# EAGLE design Arduino2 (EAGLE 6.6.0)
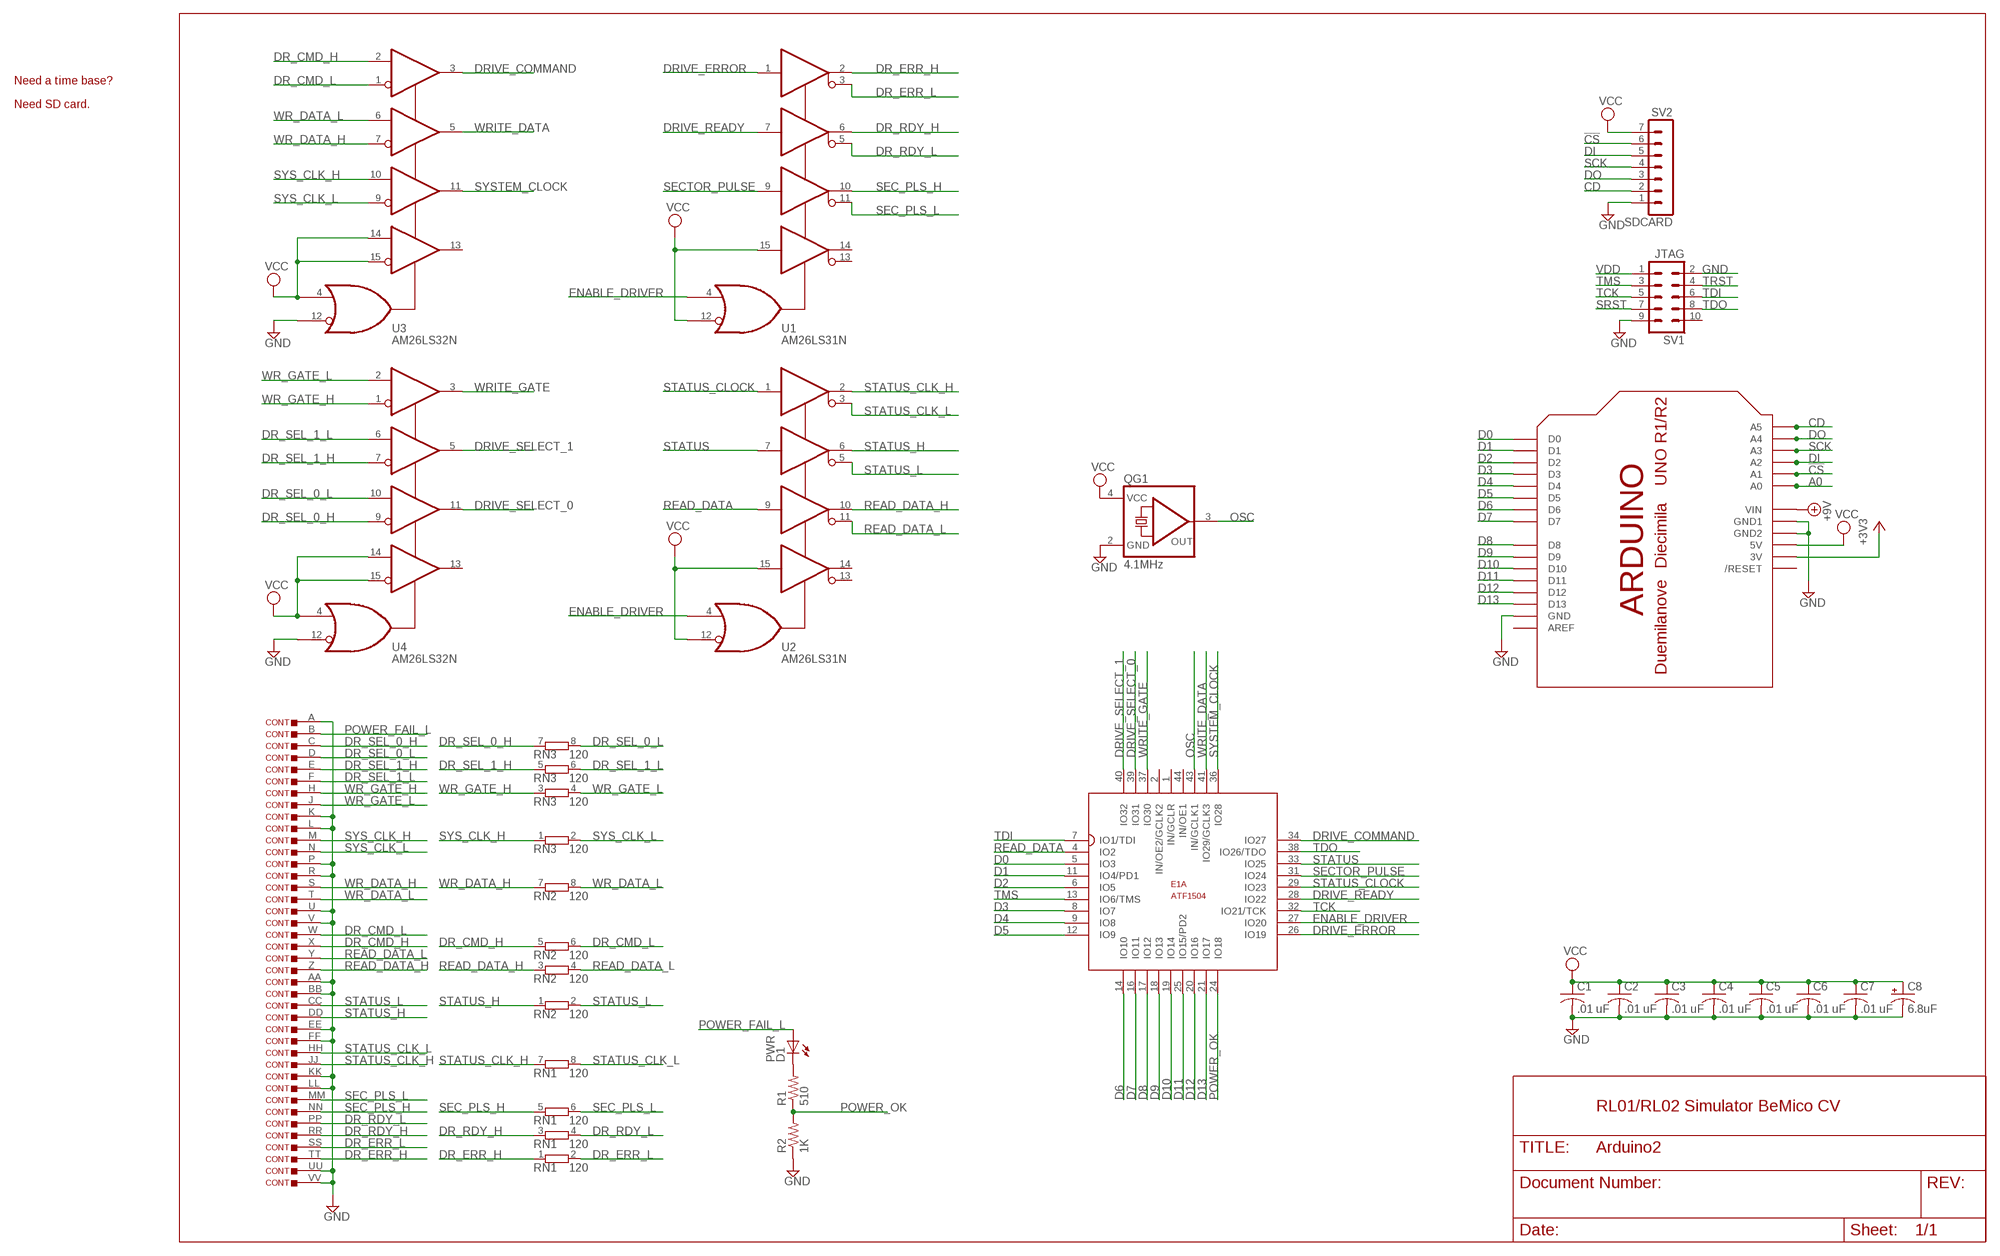
[diagram p0: schematic, sheet 1]

## Parts
C1  .01 uF  C-US050-025X075  [C050-025X075]
C2  .01 uF  C-US050-025X075  [C050-025X075]
C3  .01 uF  C-US050-025X075  [C050-025X075]
C4  .01 uF  C-US050-025X075  [C050-025X075]
C5  .01 uF  C-US050-025X075  [C050-025X075]
C6  .01 uF  C-US050-025X075  [C050-025X075]
C7  .01 uF  C-US050-025X075  [C050-025X075]
C8  6.8uF  CPOL-USE5-5  [E5-5]
CONT  DEC40PINSV  [DEC40PINV]
D1  PWR  LED5MM  [LED5MM]
E1  ATF1504  ATF150X44  [3M44]
QG1  4.1MHz  SG531  [DIL08-4]
R1  510  R-US_0207/10  [0207/10]
R2  1K  R-US_0207/10  [0207/10]
RN1  120  E4RP  [SIL8]
RN2  120  E4RP  [SIL8]
RN3  120  E4RP  [SIL8]
SV1  JTAG  ML10  [ML10]
SV2  SDCARD  MA07-1  [MA07-1]
U1  AM26LS31N  [DIL16]
U2  AM26LS31N  [DIL16]
U3  AM26LS32N  [DIL16]
U4  AM26LS32N  [DIL16]
U$3  ARDUINODUE  [ARDUINO_DUE_SHIELD]

## Nets
!CS: SV2.6 U$3.A1
+3V3: U$3.3V3(3V)
+9V: U$3.VIN
A0: U$3.A0
CD: SV2.2 U$3.A5
D0: E1.5(A:IO3) U$3.0(D0)
D1: E1.11(A:IO4/PD1) U$3.1(D1)
D2: E1.6(A:IO5) U$3.2(D2)
D3: E1.8(A:IO7) U$3.3(D3)
D4: E1.9(A:IO8) U$3.4(D4)
D5: E1.12(A:IO9) U$3.5(D5)
D6: E1.14(A:IO10) U$3.6(D6)
D7: E1.16(A:IO11) U$3.7(D7)
D8: E1.17(A:IO12) U$3.8(D8)
D9: E1.18(A:IO13) U$3.9(D9)
D10: E1.19(A:IO14) U$3.10(D10)
D11: E1.25(A:IO15/PD2) U$3.11(D11)
D12: E1.20(A:IO16) U$3.12(D12)
D13: E1.21(A:IO17) U$3.13(D13)
DI: SV2.5 U$3.A2
DO: SV2.3 U$3.A4
DR_CMD_H: CONT.X RN2.5 U3.2(P1)
DR_CMD_L: CONT.W RN2.6 U3.1(N1)
DR_ERR_H: CONT.TT RN1.1 U1.2(Y1)
DR_ERR_L: CONT.SS RN1.2 U1.3(Z1)
DR_RDY_H: CONT.RR RN1.3 U1.6(Y2)
DR_RDY_L: CONT.PP RN1.4 U1.5(Z2)
DR_SEL_0_H: CONT.C RN3.7 U4.9(N3)
DR_SEL_0_L: CONT.D RN3.8 U4.10(P3)
DR_SEL_1_H: CONT.E RN3.5 U4.7(N2)
DR_SEL_1_L: CONT.F RN3.6 U4.6(P2)
DRIVE_COMMAND: E1.34(A:IO27) U3.3(Y1)
DRIVE_ERROR: E1.26(A:IO19) U1.1(A1)
DRIVE_READY: E1.28(A:IO22) U1.7(A2)
DRIVE_SELECT_0: E1.39(A:IO31) U4.11(Y3)
DRIVE_SELECT_1: E1.40(A:IO32) U4.5(Y2)
ENABLE_DRIVER: E1.27(A:IO20) U1.4(G) U2.4(G)
GND [supply]: C1.2 C2.2 C3.2 C4.2 C5.2 C6.2 C7.2 C8.- CONT.A CONT.AA CONT.BB CONT.EE CONT.FF CONT.K CONT.KK CONT.L CONT.LL CONT.P CONT.R CONT.U CONT.UU CONT.V CONT.VV QG1.2(GND) R2.1 SV1.2 SV1.9 SV2.1 U3.12(!G) U4.12(!G) U$3.GND U$3.GND_1(GND1) U$3.GND_2(GND2)
N$1: D1.K(C) R1.2
N$2: U$3.AREF
N$9: U$3.RESET(/RESET)
OSC: E1.43(A:IN/GCLK1) QG1.3(OUT)
POWER_FAIL_L: CONT.B D1.A
POWER_OK: E1.24(A:IO18) R1.1 R2.2
READ_DATA: E1.4(A:IO2) U2.9(A3)
READ_DATA_H: CONT.Z RN2.3 U2.10(Y3)
READ_DATA_L: CONT.Y RN2.4 U2.11(Z3)
SCK: SV2.4 U$3.A3
SEC_PLS_H: CONT.NN RN1.5 U1.10(Y3)
SEC_PLS_L: CONT.MM RN1.6 U1.11(Z3)
SECTOR_PULSE: E1.31(A:IO24) U1.9(A3)
SRST: SV1.7
STATUS: E1.33(A:IO25) U2.7(A2)
STATUS_CLK_H: CONT.JJ RN1.7 U2.2(Y1)
STATUS_CLK_L: CONT.HH RN1.8 U2.3(Z1)
STATUS_CLOCK: E1.29(A:IO23) U2.1(A1)
STATUS_H: CONT.DD RN2.1 U2.6(Y2)
STATUS_L: CONT.CC RN2.2 U2.5(Z2)
SYS_CLK_H: CONT.M RN3.1 U3.10(P3)
SYS_CLK_L: CONT.N RN3.2 U3.9(N3)
SYSTEM_CLOCK: E1.36(A:IO28) U3.11(Y3)
TCK: E1.32(A:IO21/TCK) SV1.5
TDI: E1.7(A:IO1/TDI) SV1.6
TDO: E1.38(A:IO26/TDO) SV1.8
TMS: E1.13(A:IO6/TMS) SV1.3
TRST: SV1.4
VCC [supply]: C1.1 C2.1 C3.1 C4.1 C5.1 C6.1 C7.1 C8.+ QG1.4(VCC) SV2.7 U1.12(!G) U1.15(A4) U2.12(!G) U2.15(A4) U3.4(G) U3.14(P4) U3.15(N4) U4.4(G) U4.14(P4) U4.15(N4) U$3.5V0(5V)
VDD: SV1.1
WR_DATA_H: CONT.S RN2.7 U3.7(N2)
WR_DATA_L: CONT.T RN2.8 U3.6(P2)
WR_GATE_H: CONT.H RN3.3 U4.1(N1)
WR_GATE_L: CONT.J RN3.4 U4.2(P1)
WRITE_DATA: E1.41(A:IO29/GCLK3) U3.5(Y2)
WRITE_GATE: E1.37(A:IO30) U4.3(Y1)
Unconnected: E1.1(A:IN/GCLR) E1.2(A:IN/OE2/GCLK2) E1.44(A:IN/OE1) SV1.10 U1.13(Z4) U1.14(Y4) U2.13(Z4) U2.14(Y4) U3.13(Y4) U4.13(Y4)

## Notes on the sheet
- Need a time base?
- Need SD card.
- RL01/RL02 Simulator BeMico CV

## Power pins joined to a net without a drawn wire
GND: E1.10(GND) E1.22(GND) E1.30(GND) E1.42(GND) U1.8(GND) U2.8(GND) U3.8(GND) U4.8(GND)
VCC: E1.3(VCC) E1.15(VCC) E1.23(VCC) E1.35(VCC) U1.16(VCC) U2.16(VCC) U3.16(VCC) U4.16(VCC)

## Library data of the parts
C1-C7 = rcl:C-US: CAPACITOR, American symbol
C8 = rcl:CPOL-US: POLARIZED CAPACITOR, American symbol
CONT = dec-con:DEC40PINS: 40 pin ribbon connector for BC08, BC11 cables.
D1 = led:LED: LED OSRAM: - CHIPLED LG R971, LG N971, LY N971, LG Q971, LY Q971, LO R971, LY R971 LH N974, LH R974 LS Q976, LO Q976, LY Q976 LO Q996 - Hyper CHIPLED LW Q18S LB Q993, LB Q99A, LB R99A - SideLED LS A670, LO A670, LY A670, LG A670, LP A670 LB A673, LV A673, LT A673, LW A673 LH A674 LY A675 LS A676, LA A676, LO A676, LY A676, LW A676 LS A679, LY A679, LG A679 - Hyper Micro SIDELED® LS Y876, LA Y876, LO Y876, LY Y876 LT Y87S - SmartLED LW L88C, LW L88S LB L89C, LB L89S, LG L890 LS L89K, LO L89K, LY L89K LS L896, LA L896, LO L896, LY L896 - TOPLED LS T670, LO T670, LY T670, LG T670, LP T670 LSG T670, LSP T670, LSY T670, LOP T670, LYG T670 LG T671, LOG T671, LSG T671 LB T673, LV T673, LT T673, LW T673 LH T674 LS T676, LA T676, LO T676, LY T676, LB T676, LH T676, LSB T676, LW T676 LB T67C, LV T67C, LT T67C, LS T67K, LO T67K, LY T67K, LW E67C LS E67B, LA E67B, LO E67B, LY E67B, LB E67C, LV E67C, LT E67C LW T67C LS T679, LY T679, LG T679 LS T770, LO T770, LY T770, LG T770, LP T770 LB T773, LV T773, LT T773, LW T773 LH T774 LS E675, LA E675, LY E675, LS T675 LS T776, LA T776, LO T776, LY T776, LB T776 LHGB T686 LT T68C, LB T68C - Hyper Mini TOPLED® LB M676 - Mini TOPLED Santana® LG M470 LS M47K, LO M47K, LY M47K Source: http://www.osram.convergy.de LUXEON: - LUMILED® LXK2-PW12-R00, LXK2-PW12-S00, LXK2-PW14-U00, LXK2-PW14-V00 LXK2-PM12-R00, LXK2-PM12-S00, LXK2-PM14-U00 LXK2-PE12-Q00, LXK2-PE12-R00, LXK2-PE12-S00, LXK2-PE14-T00, LXK2-PE14-U00 LXK2-PB12-K00, LXK2-PB12-L00, LXK2-PB12-M00, LXK2-PB14-N00, LXK2-PB14-P00, LXK2-PB14-Q00 LXK2-PR12-L00, LXK2-PR12-M00, LXK2-PR14-Q00, LXK2-PR14-R00 LXK2-PD12-Q00, LXK2-PD12-R00, LXK2-PD12-S00 LXK2-PH12-R00, LXK2-PH12-S00 LXK2-PL12-P00, LXK2-PL12-Q00, LXK2-PL12-R00 Source: www.luxeon.com KINGBRIGHT: KA-3528ASYC Source: www.kingbright.com
E1 = atmel-cpld:ATF150X44: ATF150x in 44 pin packages
QG1 = crystal:SG531: CRYSTAL RESONATOR; MPN: SG531P16MHZ; OC_FARNELL: unknown; OC_NEWARK: 01M8837
R1 R2 = rcl:R-US_: RESISTOR, American symbol
RN1-RN3 = resistor-sil:E4RP: SIL RESISTOR; OC_FARNELL: unknown; OC_NEWARK: unknown
SV1 = con-ml:ML10: HARTING; OC_FARNELL: unknown; OC_NEWARK: unknown
SV2 = con-lstb:MA07-1: PIN HEADER; OC_FARNELL: unknown; OC_NEWARK: unknown
U1 U2 = dec-con:AM26LS31: Quad RS-422 Driver
U3 U4 = dec-con:AM26LS32: Quad Differential Reciever
U$3 = arduino:ARDUINO: Arduino Diecimila/Duemilanove Make a shield with ease, this package has all the named pins as well as the two mounting drill holes and an outline of the USB and DC power connector. The outline is on the DIMENSION layer, so if your board house uses it they will cut the outline to match. http://www.ladyada.net/library/pcb/eaglelibrary.html

## Net classes
1 supply: width 0.508 mm

## Board
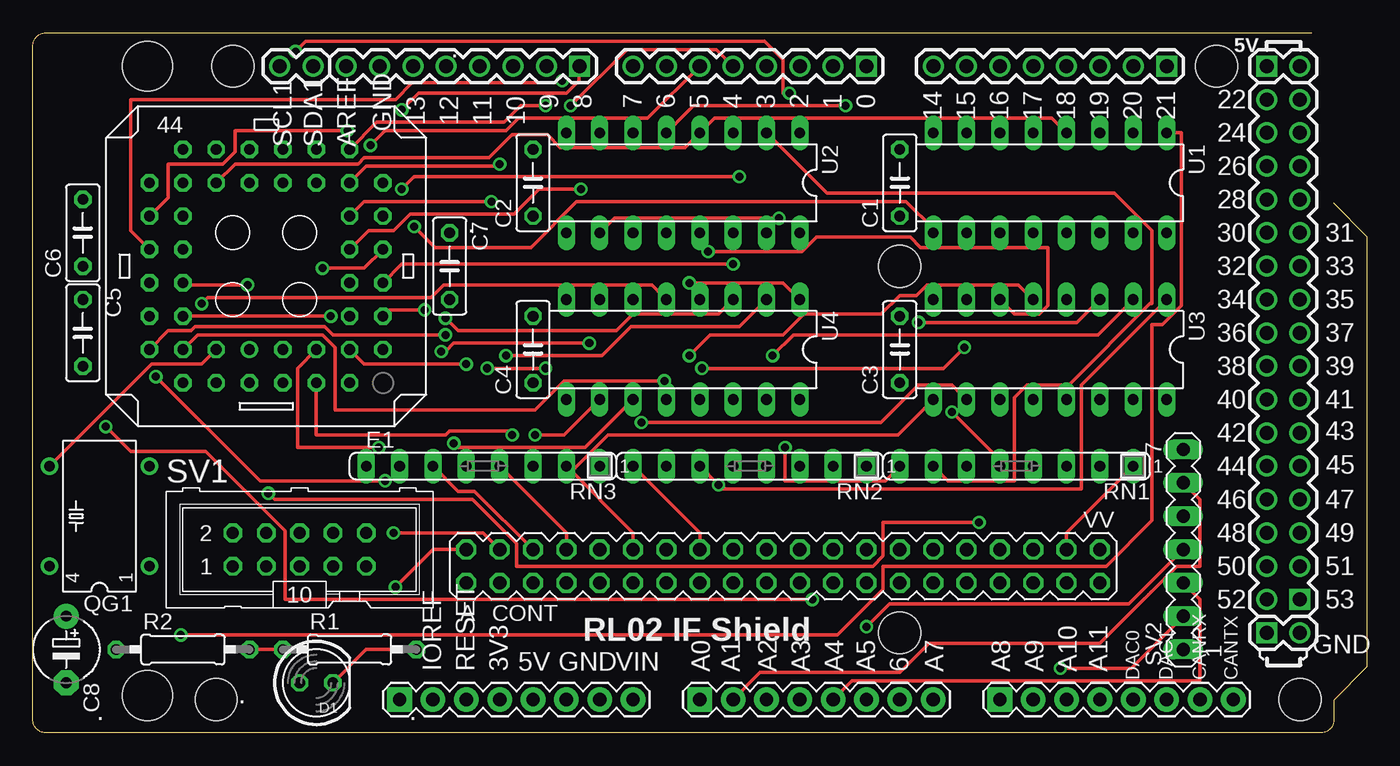
[diagram p1: board, top side]
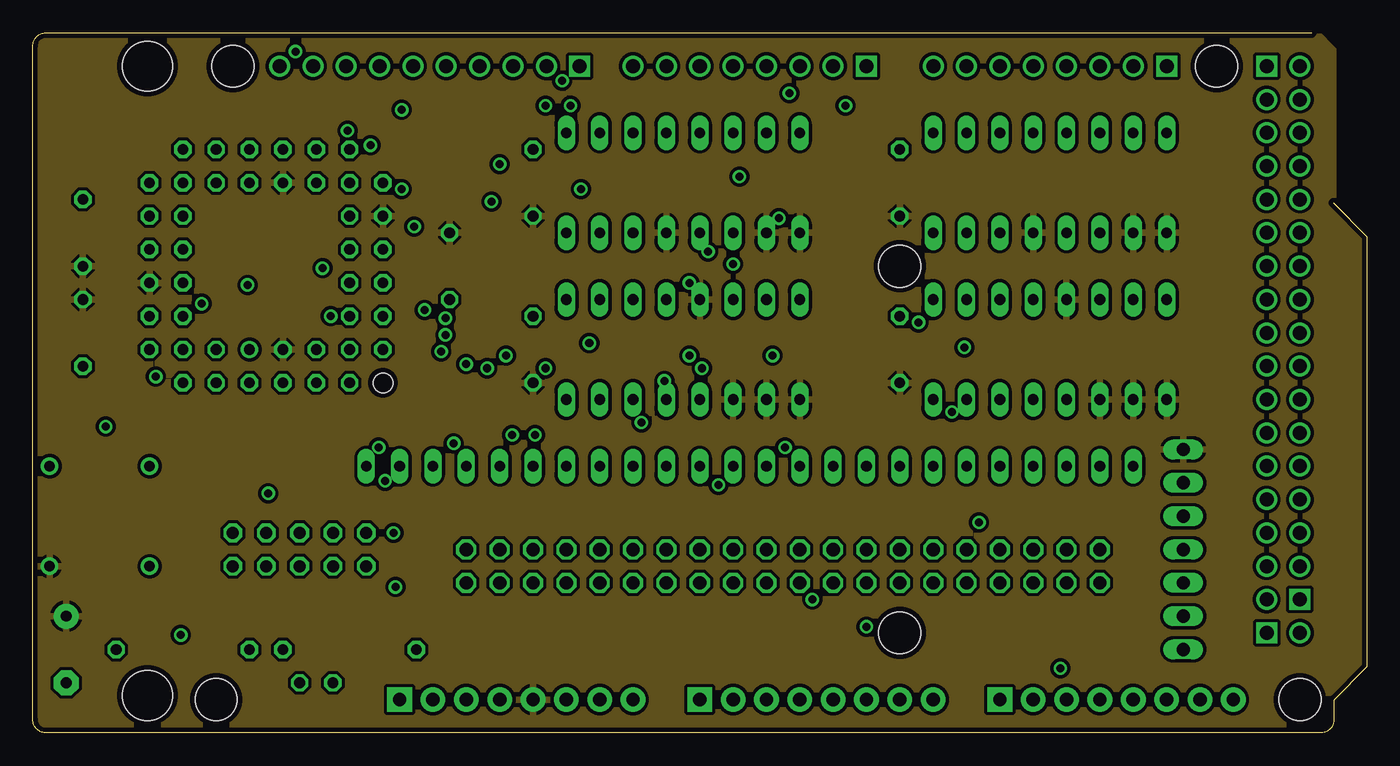
[diagram p2: board, inner layer $VCC]
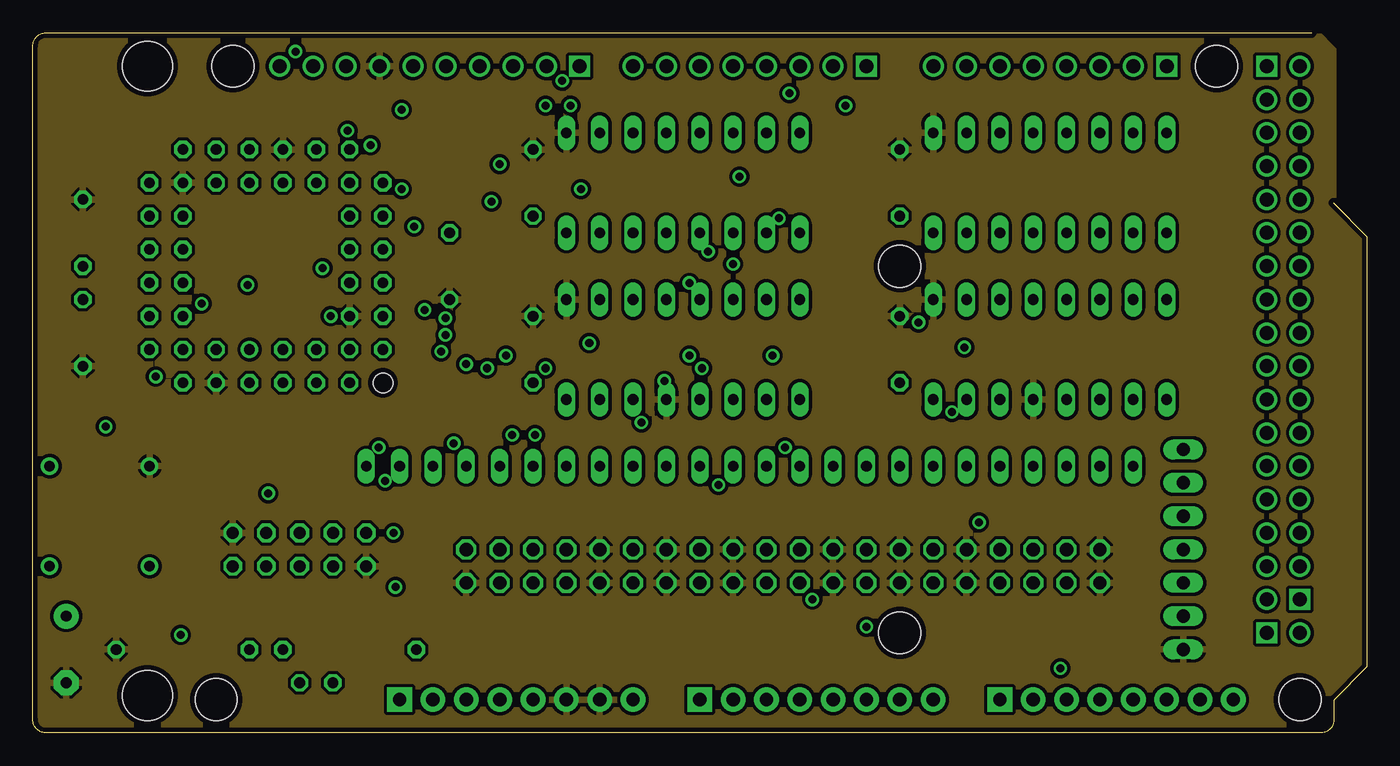
[diagram p3: board, inner layer $GND]
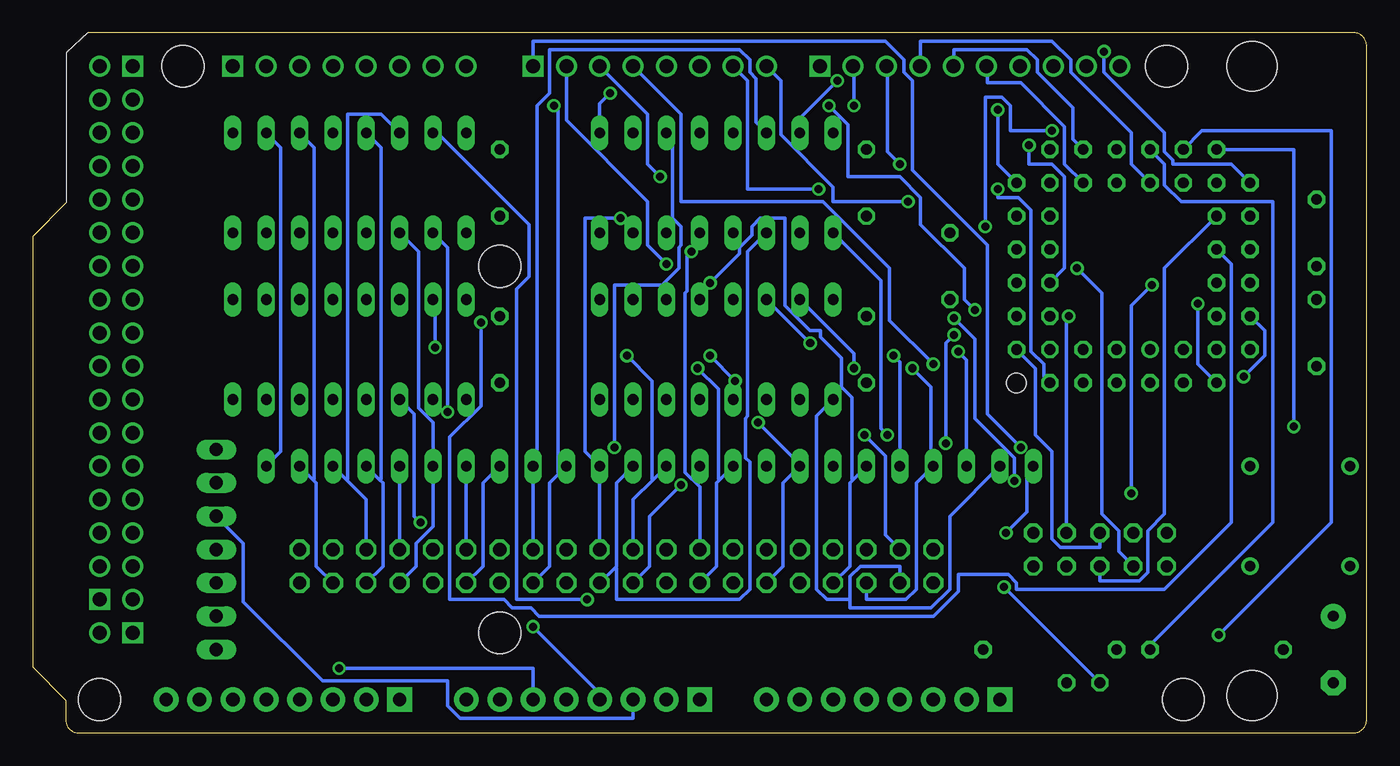
[diagram p4: board, bottom side, seen from below]

Size 101.6 x 53.34 mm. Coordinates in mm from the lower left corner, seen from the top.
Copper layers (1*2*15*16): Top 0.035mm / dielectric 1.5mm / $VCC 0.035mm / dielectric 0.15mm / $GND 0.035mm / dielectric 0.2mm / Bottom 0.035mm
Design rules "10mils *": minimum track width 10mil, minimum drill 24mil, track to track 10mil, track to pad 10mil, pad to pad 10mil, via to via 10mil, smd to smd 0mil, copper to edge 15mil, drill to drill 10mil, minimum pad ring 10mil, minimum via ring 8mil, stop-mask expansion 0mil, vias tented up to drill 0mil, thermal gap 10mil
Holes 3.81 mm at 8.73,50.8 8.73,2.86

### Footprints (pad centres in the part's own frame; a part is rotated, then mirrored left to right if it is on the bottom)
C050-025X075 = drill 0.813 octagon: 1 -2.54,0; 2 2.54,0
E5-5 = drill 0.813 pad 1.905: + -2.54,0 | drill 0.813 pad 1.905 octagon: - 2.54,0
DEC40PINV = drill 1.016 octagon: A -24.13,-1.27; AA 3.81,-1.27; B -24.13,1.27; BB 3.81,1.27; C -21.59,-1.27; CC 6.35,-1.27; D -21.59,1.27; DD 6.35,1.27; E -19.05,-1.27; EE 8.89,-1.27; F -19.05,1.27; FF 8.89,1.27; H -16.51,-1.27; HH 11.43,-1.27; J -16.51,1.27; JJ 11.43,1.27; K -13.97,-1.27; KK 13.97,-1.27; L -13.97,1.27; LL 13.97,1.27; M -11.43,-1.27; MM 16.51,-1.27; N -11.43,1.27; NN 16.51,1.27; P -8.89,-1.27; PP 19.05,-1.27; R -8.89,1.27; RR 19.05,1.27; S -6.35,-1.27; SS 21.59,-1.27; T -6.35,1.27; TT 21.59,1.27; U -3.81,-1.27; UU 24.13,-1.27; V -3.81,1.27; VV 24.13,1.27; W -1.27,-1.27; X -1.27,1.27; Y 1.27,-1.27; Z 1.27,1.27
LED5MM = drill 0.813 octagon: A -1.27,0; K 1.27,0
3M44 = drill 0.813: 1 1.27,6.35 | drill 0.813 octagon: 2 -1.27,8.89; 3 -1.27,6.35; 4 -3.81,8.89; 5 -3.81,6.35; 6 -6.35,8.89; 7 -8.89,6.35; 8 -6.35,6.35; 9 -8.89,3.81; 10 -6.35,3.81; 11 -8.89,1.27; 12 -6.35,1.27; 13 -8.89,-1.27; 14 -6.35,-1.27; 15 -8.89,-3.81; 16 -6.35,-3.81; 17 -8.89,-6.35; 18 -6.35,-8.89; 19 -6.35,-6.35; 20 -3.81,-8.89; 21 -3.81,-6.35; 22 -1.27,-8.89; 23 -1.27,-6.35; 24 1.27,-8.89; 25 1.27,-6.35; 26 3.81,-8.89; 27 3.81,-6.35; 28 6.35,-8.89; 29 8.89,-6.35; 30 6.35,-6.35; 31 8.89,-3.81; 32 6.35,-3.81; 33 8.89,-1.27; 34 6.35,-1.27; 35 8.89,1.27; 36 6.35,1.27; 37 8.89,3.81; 38 6.35,3.81; 39 8.89,6.35; 40 6.35,8.89; 41 6.35,6.35; 42 3.81,8.89; 43 3.81,6.35; 44 1.27,8.89 | hole 1.499: -8.89,8.89
DIL08-4 = drill 0.813: 1 -3.81,-3.81; 2 3.81,-3.81; 3 3.81,3.81; 4 -3.81,3.81
0207/10 = drill 0.813 octagon: 1 -5.08,0; 2 5.08,0
SIL8 = drill 0.813 long: 1 -8.89,0; 2 -6.35,0; 3 -3.81,0; 4 -1.27,0; 5 1.27,0; 6 3.81,0; 7 6.35,0; 8 8.89,0
ML10 = drill 0.914 octagon: 1 -5.08,-1.27; 2 -5.08,1.27; 3 -2.54,-1.27; 4 -2.54,1.27; 5 0,-1.27; 6 0,1.27; 7 2.54,-1.27; 8 2.54,1.27; 9 5.08,-1.27; 10 5.08,1.27
MA07-1 = drill 1.016 long: 1 -7.62,0; 2 -5.08,0; 3 -2.54,0; 4 0,0; 5 2.54,0; 6 5.08,0; 7 7.62,0
DIL16 = drill 0.813 long: 1 -8.89,-3.81; 2 -6.35,-3.81; 3 -3.81,-3.81; 4 -1.27,-3.81; 5 1.27,-3.81; 6 3.81,-3.81; 7 6.35,-3.81; 8 8.89,-3.81; 9 8.89,3.81; 10 6.35,3.81; 11 3.81,3.81; 12 1.27,3.81; 13 -1.27,3.81; 14 -3.81,3.81; 15 -6.35,3.81; 16 -8.89,3.81
ARDUINO_DUE_SHIELD = drill 1.067 square: 0 63.5,50.8; 5V0_1 93.98,50.8; 8 41.656,50.8; 21 86.36,50.8; 53 96.52,10.16; GND_4 93.98,7.62 | drill 1.067: 1 60.96,50.8; 2 58.42,50.8; 3 55.88,50.8; 4 53.34,50.8; 5 50.8,50.8; 5V0_2 96.52,50.8; 6 48.26,50.8; 7 45.72,50.8; 9 39.116,50.8; 10 36.576,50.8; 11 34.036,50.8; 12 31.496,50.8; 13 28.956,50.8; 14 68.58,50.8; 15 71.12,50.8; 16 73.66,50.8; 17 76.2,50.8; 18 78.74,50.8; 19 81.28,50.8; 20 83.82,50.8; 22 93.98,48.26; 23 96.52,48.26; 24 93.98,45.72; 25 96.52,45.72; 26 93.98,43.18; 27 96.52,43.18; 28 93.98,40.64; 29 96.52,40.64; 30 93.98,38.1; 31 96.52,38.1; 32 93.98,35.56; 33 96.52,35.56; 34 93.98,33.02; 35 96.52,33.02; 36 93.98,30.48; 37 96.52,30.48; 38 93.98,27.94; 39 96.52,27.94; 40 93.98,25.4; 41 96.52,25.4; 42 93.98,22.86; 43 96.52,22.86; 44 93.98,20.32; 45 96.52,20.32; 46 93.98,17.78; 47 96.52,17.78; 48 93.98,15.24; 49 96.52,15.24; 50 93.98,12.7; 51 96.52,12.7; 52 93.98,10.16; AREF 23.876,50.8; GND_2 26.416,50.8; GND_3 96.52,7.62; SCL1 18.796,50.8; SDA1 21.336,50.8 | drill 1.016 pad 1.88: 3V3 35.56,2.54; 5V0 38.1,2.54; A1 53.34,2.54; A2 55.88,2.54; A3 58.42,2.54; A4 60.96,2.54; A5 63.5,2.54; A6 66.04,2.54; A7 68.58,2.54; A9 76.2,2.54; A10 78.74,2.54; A11 81.28,2.54; CANRX 88.9,2.54; CANTX 91.44,2.54; DAC0 83.82,2.54; DAC1 86.36,2.54; GND 40.64,2.54; GND_1 43.18,2.54; IOREF 30.48,2.54; RESET 33.02,2.54; VIN 45.72,2.54 | drill 1.016 pad 1.88 square: A0 50.8,2.54; A8 73.66,2.54; NC_2 27.94,2.54 | hole 3.2: 96.52,2.54; 15.24,50.8; 90.17,50.8; 13.97,2.54; 66.04,35.56; 66.04,7.62

### Placement (x,y rotation side)
C1  66.04,41.91 90 top
C2  38.1,41.91 90 top
C3  66.04,29.21 90 top
C4  38.1,29.21 90 top
C5  3.81,30.48 270 top
C6  3.81,38.1 90 top
C7  31.75,35.56 270 top
C8  2.54,6.35 270 top
CONT  57.15,12.7 0 top
D1  21.59,3.81 0 top
E1  17.78,35.56 180 top
QG1  5.08,16.51 90 top
R1  24.13,6.35 0 top
R2  11.43,6.35 0 top
RN1  74.93,20.32 180 top
RN2  54.61,20.32 180 top
RN3  34.29,20.32 180 top
SV1  20.32,13.97 0 top
SV2  87.63,13.97 90 top
U1  77.47,41.91 180 top
U2  49.53,41.91 180 top
U3  77.47,29.21 180 top
U4  49.53,29.21 180 top
U$3  0,0 0 top

### Tracks (layer width: path | path; a pad name or v marks a point on that pad's centre or on a via)
!CS
  Top 0.254: SV2.6 88.9,17.78 88.9,12.7 87.15,12.7 81.28,6.83 68.26,6.83 66.04,4.6 55.4,4.6 U$3.A1
CD  (via drill 0.61)
  Top 0.254: SV2.2 83.66,4.92 v78.26,4.92
  Bottom 0.254: v78.26,4.92 63.5,4.92 U$3.A5
D0  (via drill 0.61)
  Top 0.254: E1.5 20.16,27.78 20.16,21.75 v26.35,21.75
  Bottom 0.254: v26.35,21.75 28.89,24.29 28.89,37.15 34.61,42.86 34.61,49.69 35.24,50.32 35.24,51.28 36.67,52.7 63.5,52.7 U$3.0
D1  (via drill 0.61)
  Top 0.254: E1.11 28.1,35.72 v53.34,35.72
  Bottom 0.254: v53.34,35.72 54.77,37.15 54.77,40.48 60.96,46.67 U$3.1
D2  (via drill 0.61)
  Top 0.254: v28.1,41.43 29.05,42.39 v53.82,42.39
  Bottom 0.254: E1.6 24.61,27.15 24.61,28.1 25.56,29.05 25.56,39.85 26.51,40.8 28.1,40.8 v28.1,41.43 | v53.82,42.39 54.77,43.34 54.77,47.15 U$3.2
D3  (via drill 0.61)
  Top 0.254: E1.8 25.24,28.1 v33.02,28.1
  Bottom 0.254: v33.02,28.1 36.35,31.43 36.35,35.4 41.43,40.48 52.23,40.48 52.23,47.15 U$3.3
D4  (via drill 0.61)
  Top 0.254: E1.9 27.15,32.23 v29.84,32.23 | v40.96,47.78 45.24,52.07 52.07,52.07 U$3.4
  Bottom 0.254: v29.84,32.23 30.64,33.02 30.64,35.4 33.97,38.73 33.97,40.8 35.56,42.39 39.53,42.39 39.53,46.35 v40.96,47.78
D5  (via drill 0.61)
  Top 0.254: v25.72,44.77 26.83,45.88 36.04,45.88 36.99,46.83 46.83,46.83 U$3.5
  Bottom 0.254: E1.12 23.02,35.4 23.02,42.39 23.97,43.34 25.72,43.34 v25.72,44.77
D6  (via drill 0.61)
  Top 0.254: E1.14 25.56,38.26 27.46,38.26 28.73,39.53 36.67,39.53 38.58,41.43 v41.75,41.43
  Bottom 0.254: v41.75,41.43 47.15,41.43 47.15,49.69 U$3.6
D7  (via drill 0.61)
  Top 0.254: E1.16 25.24,40.48 v34.92,40.48
  Bottom 0.254: v34.92,40.48 40.64,40.48 40.64,41.59 44.61,45.56 44.61,49.69 U$3.7
D8  (via drill 0.61)
  Top 0.254: v28.1,47.47 29.37,48.74 40.64,48.74 41.59,49.69 41.59,50.8 U$3.8
  Bottom 0.254: E1.17 28.1,43.34 v28.1,47.47
D9  (via drill 0.61)
  Top 0.254: E1.18 26.19,46.51 35.88,46.51 37.15,47.78 v39.05,47.78
  Bottom 0.254: v39.05,47.78 39.05,50.8 U$3.9
D10  (via drill 0.61)
  Top 0.254: E1.19 25.4,43.18 35.4,43.18 v35.56,43.34
  Bottom 0.254: v35.56,43.34 36.51,44.29 36.51,50.8 U$3.10
D11
  Bottom 0.254: E1.25 17.94,43.34 17.94,45.72 22.54,50.32 22.54,51.28 23.97,52.7 33.97,52.7 33.97,50.8 U$3.11
D12
  Bottom 0.254: E1.20 22.38,45.24 22.38,47.62 25.08,50.32 25.08,51.28 25.88,52.07 31.43,52.07 31.43,50.8 U$3.12
D13
  Bottom 0.254: E1.21 23.02,43.34 23.02,46.2 26.35,49.53 28.89,49.53 28.89,50.8 U$3.13
DI
  Bottom 0.254: SV2.5 85.57,14.45 85.57,10 79.53,3.97 70.01,3.97 70.01,2.06 69.06,1.11 55.88,1.11 U$3.A2
DO
  Top 0.254: SV2.3 88.9,10.16 88.9,3.97 62.39,3.97 U$3.A4
DR_CMD_H  (via drill 0.61)
  Top 0.254: U3.2 81.12,30.32 57.94,30.32 v56.36,28.73
  Bottom 0.254: 54.37,19.29 55.88,17.78 CONT.X | 54.37,19.29 RN2.5 | v56.36,28.73 54.45,26.83 54.45,19.37 54.37,19.29
DR_CMD_L  (via drill 0.61)
  Top 0.254: RN2.6 v52.23,18.89 52.55,18.57 79.85,18.57 79.85,26.51 U3.1
  Bottom 0.254: v52.23,18.89 54.61,16.51 54.61,12.7 CONT.W
DR_ERR_H
  Top 0.254: RN1.1 78.74,15.24 CONT.TT
  Bottom 0.254: U1.2 82.71,44.61 82.71,21.43 RN1.1
DR_ERR_L
  Bottom 0.254: 80.25,19.29 80.01,19.05 80.01,12.7 CONT.SS | 80.25,19.29 RN1.2 | U1.3 80.17,44.61 80.17,19.37 80.25,19.29
DR_RDY_H
  Bottom 0.254: 77.71,19.29 76.2,17.78 CONT.RR | 77.71,19.29 RN1.3 | U1.6 75.09,47.15 77.63,47.15 77.63,19.37 77.71,19.29
DR_RDY_L
  Bottom 0.254: 75.17,19.29 74.93,19.05 74.93,12.7 CONT.PP | 75.17,19.29 RN1.4 | U1.5 75.09,44.61 75.09,19.37 75.17,19.29
DR_SEL_0_H
  Bottom 0.254: RN3.7 31.75,16.51 31.75,10.95 33.18,9.53 39.37,9.53 39.37,10.16 | 39.37,10.16 39.37,11.91 38.58,12.7 35.56,12.7 CONT.C | U4.9 41.91,24.13 41.91,10.95 41.12,10.16 39.37,10.16
DR_SEL_0_L  (via drill 0.61)
  Top 0.254: v27.46,15.24 34.29,15.24 CONT.D | U4.10 40.48,22.7 v38.26,22.7
  Bottom 0.254: RN3.8 25.88,19.84 25.88,16.83 v27.46,15.24 | v38.26,22.7 36.67,21.11 36.67,15.08 CONT.D
DR_SEL_1_H  (via drill 0.61)
  Top 0.254: v34.61,27.78 v39.05,27.78
  Bottom 0.254: CONT.E 38.1,10.16 35.08,10.16 34.29,10.95 34.29,19.05 RN3.5 33.18,20.32 33.18,26.35 v34.61,27.78 | U4.7 39.05,28.89 v39.05,27.78
DR_SEL_1_L  (via drill 0.61)
  Top 0.254: RN3.6 32.38,18.41 33.66,18.41 CONT.F | v42.39,29.69 32.07,29.69 31.43,29.05 v31.11,29.05
  Bottom 0.254: v42.39,29.69 U4.6 | v31.11,29.05 30.48,28.42 RN3.6
DRIVE_COMMAND  (via drill 0.61)
  Top 0.254: v67.47,31.27 79.53,31.27 U3.3
  Bottom 0.254: E1.34 10.32,35.72 10.32,16.03 15.4,10.95 26.67,10.95 26.67,11.43 27.3,12.06 31.11,12.06 31.11,10.79 33.02,8.89 63.02,8.89 63.66,9.53 65.09,9.53 65.72,10.16 69.85,10.16 69.85,22.54 67.47,24.92 v67.47,31.27
DRIVE_ERROR  (via drill 0.61)
  Top 0.254: v11.27,7.46 61.28,7.46 64.77,10.95 64.77,12.7 81.76,12.7 85.25,16.19 85.25,31.11 86.04,31.11 87.47,32.54 87.47,45.72 U1.1
  Bottom 0.254: E1.26 12.54,45.88 2.7,45.88 2.7,16.03 v11.27,7.46
DRIVE_READY  (via drill 0.61)
  Top 0.254: v5.56,23.34 7.46,21.43 13.18,21.43 19.21,15.4 19.21,10.16 v59.37,10.16
  Bottom 0.254: E1.28 5.56,44.45 v5.56,23.34 | v59.37,10.16 64.77,10.16 64.77,33.81 63.82,34.77 63.82,38.73 70.8,45.72 U1.7
DRIVE_SELECT_0  (via drill 0.61)
  Top 0.254: E1.39 10.32,30.64 12.06,30.64 12.38,30.96 22.23,30.96 22.86,30.32 v31.43,30.32 | v32.07,22.07 32.38,21.75 42.07,21.75 U4.11
  Bottom 0.254: v31.43,30.32 32.07,29.69 v32.07,22.07
DRIVE_SELECT_1  (via drill 0.61)
  Top 0.254: v12.86,32.7 13.34,33.18 30.32,33.18 31.27,34.13 47.15,34.13 U4.5
  Bottom 0.254: E1.40 12.86,28.1 v12.86,32.7
ENABLE_DRIVER
  Top 0.254: E1.27 15.4,43.34 24.77,43.34 25.24,43.81 34.77,43.81 36.51,45.56 39.21,45.56 40.16,44.61 49.69,44.61 U2.4 51.91,46.83 77.63,46.83 U1.4
GND
  pour $GND: 0,0 99.06,0 99.06,2.54 101.6,5.08 101.6,38.1 99.06,40.64 99.06,52.07 97.79,53.34 0,53.34
N$1
  Top 0.254: D1.K 25.4,6.35 R1.2
OSC
  Top 0.254: QG1.3 9.05,28.1 12.86,28.1 E1.43
POWER_FAIL_L  (via drill 0.61)
  Top 0.254: v27.62,11.11 30.48,13.97 CONT.B
  Bottom 0.254: v27.62,11.11 D1.A
POWER_OK
  Top 0.254: R1.1 R2.2
  Bottom 0.254: E1.24 15.4,43.34 15.4,41.75 14.13,40.48 7.14,40.48 7.14,16.03 16.51,6.67 R2.2
READ_DATA  (via drill 0.61)
  Top 0.254: E1.4 21.59,22.7 31.43,22.7 31.75,23.02 36.2,23.02 v36.51,22.7
  Bottom 0.254: v36.51,22.7 36.99,23.18 36.99,34.45 U2.9
READ_DATA_H  (via drill 0.61)
  Top 0.254: U2.10 44.29,39.21 v56.83,39.21
  Bottom 0.254: CONT.Z RN2.3 59.53,21.43 59.53,39.21 v56.83,39.21
READ_DATA_L
  Bottom 0.254: RN2.4 57.15,19.05 57.15,12.7 57.23,12.62 | CONT.Y 57.23,12.62 | U2.11 47.15,36.67 47.15,24.13 47.31,23.97 47.31,20.95 46.99,20.64 46.99,10.95 47.78,10.16 57.15,10.16 57.15,12.54 57.23,12.62
SCK  (via drill 0.61)
  Top 0.254: SV2.4 83.5,9.84 65.25,9.84 v63.5,8.1
  Bottom 0.254: v63.5,8.1 58.42,3.02 U$3.A3
SEC_PLS_H  (via drill 0.61)
  Top 0.254: v70.01,24.45 73.66,20.8 RN1.5
  Bottom 0.254: CONT.NN RN1.5 | U1.10 70.01,36.99 v70.01,24.45
SEC_PLS_L
  Bottom 0.254: CONT.MM 72.39,12.7 72.39,14.45 71.12,15.72 RN1.6 71.12,23.65 72.23,24.77 72.23,36.67 U1.11
SECTOR_PULSE  (via drill 0.61)
  Top 0.254: E1.31 10.32,40.8 10.32,43.34 14.45,43.34 15.4,44.29 15.4,45.88 v23.97,45.88 | v29.05,38.58 30.64,36.99 37.94,36.99 41.43,40.48 66.52,40.48 68.58,38.42 U1.9
  Bottom 0.254: v23.97,45.88 27.15,45.88 27.15,47.78 27.78,48.42 29.05,48.42 v29.05,38.58
STATUS  (via drill 0.61)
  Top 0.254: E1.33 7.46,38.26 7.46,48.26 27.62,48.26 28.89,49.53 40.16,49.53 v40.32,49.69
  Bottom 0.254: v40.32,49.69 43.18,46.83 U2.7
STATUS_CLK_H
  Top 0.254: U2.2 60.48,41.12 82.39,41.12 85.25,38.26 85.25,32.7 85.09,32.7 78.9,26.51 75.72,26.51 74.77,25.56 74.77,19.21 69.69,19.21 RN1.7
  Bottom 0.254: CONT.JJ RN1.7
STATUS_CLK_L  (via drill 0.61)
  Top 0.254: v57.31,21.75 57.31,19.21 64.93,19.21 RN1.8
  Bottom 0.254: RN1.8 67.31,19.05 67.31,12.7 CONT.HH | U2.3 52.86,45.24 52.86,39.21 52.23,38.58 52.23,37.15 52.39,36.99 52.39,35.4 53.66,34.13 57.31,34.13 v57.31,21.75
STATUS_CLOCK  (via drill 0.61)
  Top 0.254: v20,51.91 20.8,52.7 55.72,52.7 57.15,51.28 57.15,48.74 v57.63,48.74
  Bottom 0.254: E1.29 10.32,43.34 14.76,43.34 14.76,43.66 15.4,44.29 15.4,45.72 20,50.32 v20,51.91 | v57.63,48.74 58.42,47.94 U2.1
STATUS_H
  Bottom 0.254: CONT.DD RN2.1 63.18,20.64 63.18,47.78 62.23,48.74 62.23,52.07 47.78,52.07 46.99,51.28 46.99,50.32 46.51,49.85 46.51,46.51 U2.6
STATUS_L  (via drill 0.61)
  Top 0.254: U2.5 50.32,47.78 v61.91,47.78
  Bottom 0.254: 61.52,19.76 62.23,19.05 62.23,12.7 CONT.CC | 61.52,19.76 RN2.2 | v61.91,47.78 61.59,47.47 61.59,19.84 61.52,19.76
SYS_CLK_H  (via drill 0.61)
  Top 0.254: U3.10 70.01,26.51 67.47,26.51 64.61,23.65 v46.35,23.65
  Bottom 0.254: CONT.M 44.45,12.7 44.45,19.05 RN3.1 43.34,20.32 43.34,20.64 v46.35,23.65
SYS_CLK_L
  Top 0.254: CONT.N 45.72,15.24 RN3.2 41.12,20 43.81,22.7 65.88,22.7 U3.9
SYSTEM_CLOCK  (via drill 0.61)
  Top 0.254: E1.36 11.59,34.13 v16.35,34.13 | v17.94,18.26 18.41,17.78 33.5,17.78 36.83,14.45 36.83,12.7 63.98,12.7 64.77,13.49 64.77,16.03 v72.07,16.03
  Bottom 0.254: v16.35,34.13 17.94,32.54 v17.94,18.26 | v72.07,16.03 72.55,16.51 72.55,24.29 U3.11
TCK
  Bottom 0.254: E1.32 15.4,35.4 15.4,16.67 16.67,15.4 16.67,12.22 17.3,11.59 20.32,11.59 SV1.5
TDI
  Bottom 0.254: E1.7 25.24,27.78 25.24,22.7 23.97,21.43 23.97,14.76 23.34,14.13 20.32,14.13 SV1.6
TDO  (via drill 0.61)
  Top 0.254: v22.7,31.75 E1.38
  Bottom 0.254: v22.7,31.75 22.86,31.59 SV1.8
TMS  (via drill 0.61)
  Top 0.254: E1.13 25.24,35.4 v22.07,35.4
  Bottom 0.254: v22.07,35.4 20.16,33.5 20.16,16.67 18.89,15.4 18.89,13.81 SV1.3
VCC
  pour $VCC: 0,0 99.06,0 99.06,2.54 101.6,5.08 101.6,38.1 99.06,40.64 99.06,52.07 97.79,53.34 0,53.34
WR_DATA_H  (via drill 0.61)
  Top 0.254: v70.96,29.37 69.37,27.78 v50.96,27.78
  Bottom 0.254: 49.29,19.29 49.53,19.05 49.53,12.7 CONT.S | 49.29,19.29 RN2.7 | U3.7 70.96,32.86 v70.96,29.37 | v50.96,27.78 49.37,26.19 49.37,19.37 49.29,19.29
WR_DATA_L  (via drill 0.61)
  Top 0.254: RN2.8 50.8,15.24 CONT.T | U3.6 74.77,31.91 76.68,31.91 77.31,32.54 77.31,36.99 67.63,36.99 66.83,37.78 59.69,37.78 58.58,36.67 v51.44,36.67
  Bottom 0.254: v51.44,36.67 51.75,36.35 51.75,33.66 51.91,33.5 51.91,19.84 50.8,18.73 CONT.T
WR_GATE_H  (via drill 0.61)
  Top 0.254: U4.1 57.15,34.29 v50.01,34.29
  Bottom 0.254: 39.13,19.29 39.37,19.05 39.37,12.7 CONT.H | 39.13,19.29 RN3.3 | v50.01,34.29 47.78,36.51 47.78,36.99 46.83,37.94 46.83,38.58 46.2,39.21 44.29,39.21 44.29,32.54 42.39,30.64 41.59,30.64 41.59,30.16 40.01,28.57 40.01,26.35 39.21,25.56 39.21,19.37 39.13,19.29
WR_GATE_L  (via drill 0.61)
  Top 0.254: RN3.4 40.64,15.24 CONT.J | U4.2 53.82,30.96 45.56,30.96 43.34,28.73 v36.04,28.73
  Bottom 0.254: v36.04,28.73 35.56,28.26 RN3.4
WRITE_DATA  (via drill 0.61)
  Top 0.254: E1.41 12.54,30.32 22.07,30.32 23.02,29.37 23.02,24.61 38.26,24.61 40.48,26.83 v48.1,26.83 | v50.01,28.73 51.59,30.32 57.15,30.32 58.74,31.91 64.61,31.91 66.04,33.34 67.31,33.34 68.1,34.13 75.09,34.13 U3.5
  Bottom 0.254: v50.01,28.73 v48.1,26.83
WRITE_GATE  (via drill 0.61)
  Top 0.254: v9.37,27.15 17.3,19.21 v26.83,19.21 | v31.43,31.59 32.38,30.64 44.45,30.64 45.72,31.91 52.23,31.91 U4.3
  Bottom 0.254: E1.37 7.78,30.64 7.78,28.73 v9.37,27.15 | v26.83,19.21 26.83,20.95 29.84,23.97 29.84,30 v31.43,31.59

### Text on the board
tNames: . | . | RL02 IF Shield | . | . | .